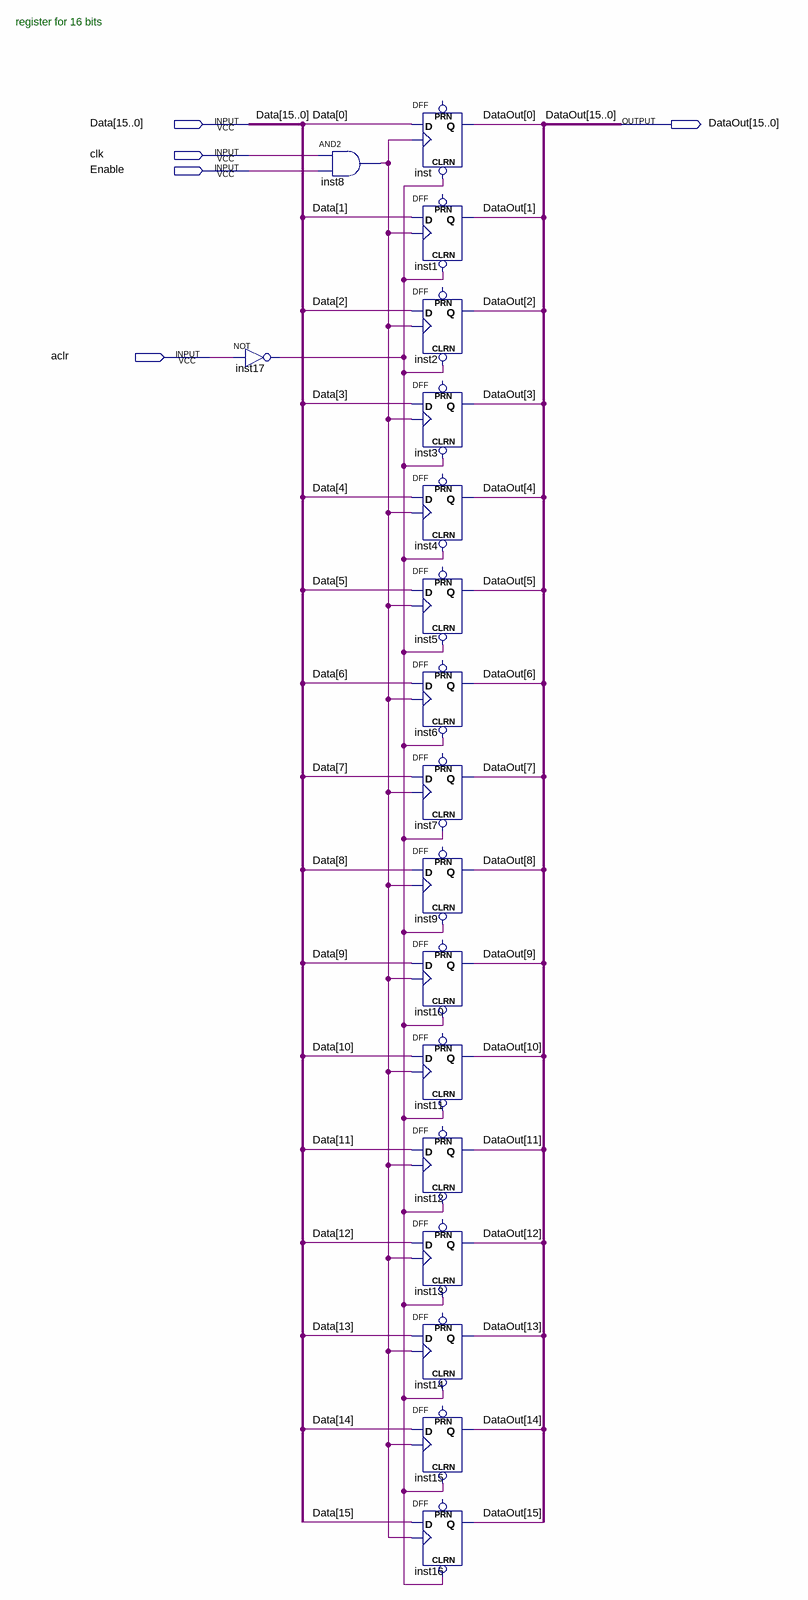
[diagram p0: schematic sheet]
// Quartus schematic reg16.bdf as structural Verilog: 18 symbols, 5 pins
module reg16 (
  input  [15:0] Data,
  input  clk,
  input  Enable,
  input  aclr,
  output [15:0] DataOut
);

  wire inst8_out, inst17_out;

  not inst17 (inst17_out, aclr);
  and inst8 (inst8_out, clk, Enable);
  DFF inst (.CLRN(inst17_out), .CLK(inst8_out), .D(Data[0]), .Q(DataOut[0]));  // open: PRN
  DFF inst1 (.CLRN(inst17_out), .CLK(inst8_out), .D(Data[1]), .Q(DataOut[1]));  // open: PRN
  DFF inst2 (.CLRN(inst17_out), .CLK(inst8_out), .D(Data[2]), .Q(DataOut[2]));  // open: PRN
  DFF inst3 (.CLRN(inst17_out), .CLK(inst8_out), .D(Data[3]), .Q(DataOut[3]));  // open: PRN
  DFF inst4 (.CLRN(inst17_out), .CLK(inst8_out), .D(Data[4]), .Q(DataOut[4]));  // open: PRN
  DFF inst5 (.CLRN(inst17_out), .CLK(inst8_out), .D(Data[5]), .Q(DataOut[5]));  // open: PRN
  DFF inst6 (.CLRN(inst17_out), .CLK(inst8_out), .D(Data[6]), .Q(DataOut[6]));  // open: PRN
  DFF inst7 (.CLRN(inst17_out), .CLK(inst8_out), .D(Data[7]), .Q(DataOut[7]));  // open: PRN
  DFF inst9 (.CLRN(inst17_out), .CLK(inst8_out), .D(Data[8]), .Q(DataOut[8]));  // open: PRN
  DFF inst10 (.CLRN(inst17_out), .CLK(inst8_out), .D(Data[9]), .Q(DataOut[9]));  // open: PRN
  DFF inst11 (.CLRN(inst17_out), .CLK(inst8_out), .D(Data[10]), .Q(DataOut[10]));  // open: PRN
  DFF inst12 (.CLRN(inst17_out), .CLK(inst8_out), .D(Data[11]), .Q(DataOut[11]));  // open: PRN
  DFF inst13 (.CLRN(inst17_out), .CLK(inst8_out), .D(Data[12]), .Q(DataOut[12]));  // open: PRN
  DFF inst14 (.CLRN(inst17_out), .CLK(inst8_out), .D(Data[13]), .Q(DataOut[13]));  // open: PRN
  DFF inst15 (.CLRN(inst17_out), .CLK(inst8_out), .D(Data[14]), .Q(DataOut[14]));  // open: PRN
  DFF inst16 (.CLRN(inst17_out), .CLK(inst8_out), .D(Data[15]), .Q(DataOut[15]));  // open: PRN

  // Notes on the sheet:
  //   register for 16 bits
endmodule
